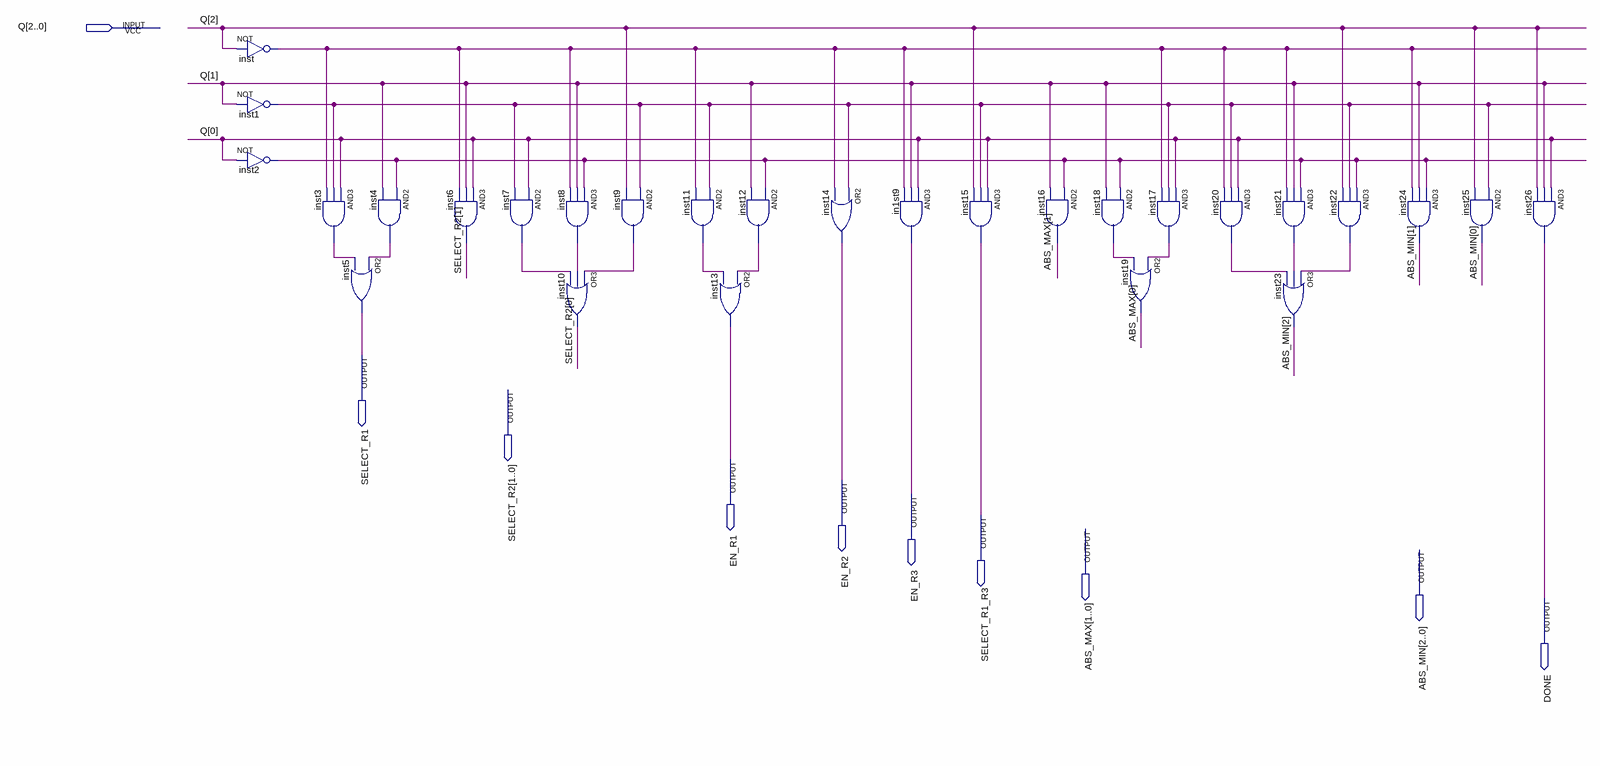
[diagram p0: schematic sheet]
// Quartus schematic OUTPUT_ENCODER_SF.bdf as structural Verilog: 28 symbols, 10 pins
module OUTPUT_ENCODER_SF (
  input  [2:0] Q,
  output SELECT_R1,
  output [1:0] SELECT_R2,
  output EN_R1,
  output EN_R2,
  output EN_R3,
  output SELECT_R1_R3,
  output [1:0] ABS_MAX,
  output [2:0] ABS_MIN,
  output DONE
);

  wire inst1_out, inst2_out, inst3_out, inst4_out, inst7_out, inst8_out, inst9_out, inst11_out, inst12_out,
       inst17_out, inst18_out, inst20_out, inst21_out, inst22_out, inst_out;

  not inst (inst_out, Q[2]);
  not inst1 (inst1_out, Q[1]);
  not inst2 (inst2_out, Q[0]);
  and inst3 (inst3_out, Q[0], inst1_out, inst_out);
  or inst5 (SELECT_R1, inst4_out, inst3_out);
  and inst4 (inst4_out, inst2_out, Q[1]);
  and inst6 (SELECT_R2[1], Q[0], Q[1], inst_out);
  and inst7 (inst7_out, Q[0], inst1_out);
  and inst8 (inst8_out, inst2_out, Q[1], inst_out);
  or inst10 (SELECT_R2[0], inst9_out, inst8_out, inst7_out);
  and inst9 (inst9_out, inst1_out, Q[2]);
  and inst11 (inst11_out, inst1_out, inst_out);
  and inst12 (inst12_out, inst2_out, Q[1]);
  or inst13 (EN_R1, inst12_out, inst11_out);
  or inst14 (EN_R2, inst1_out, inst_out);
  and in1st9 (EN_R3, Q[0], Q[1], inst_out);
  and inst15 (SELECT_R1_R3, Q[0], inst1_out, Q[2]);
  and inst16 (ABS_MAX[1], inst2_out, Q[1]);
  and inst18 (inst18_out, inst2_out, Q[1]);
  or inst19 (ABS_MAX[0], inst17_out, inst18_out);
  and inst17 (inst17_out, Q[0], inst1_out, inst_out);
  and inst20 (inst20_out, Q[0], inst1_out, inst_out);
  and inst21 (inst21_out, inst2_out, Q[1], inst_out);
  or inst23 (ABS_MIN[2], inst22_out, inst21_out, inst20_out);
  and inst22 (inst22_out, inst2_out, inst1_out, Q[2]);
  and inst24 (ABS_MIN[1], inst2_out, Q[1], inst_out);
  and inst25 (ABS_MIN[0], inst1_out, Q[2]);
  and inst26 (DONE, Q[0], Q[1], Q[2]);
endmodule
